# EAGLE schematic V1a (EAGLE 6.5.0)
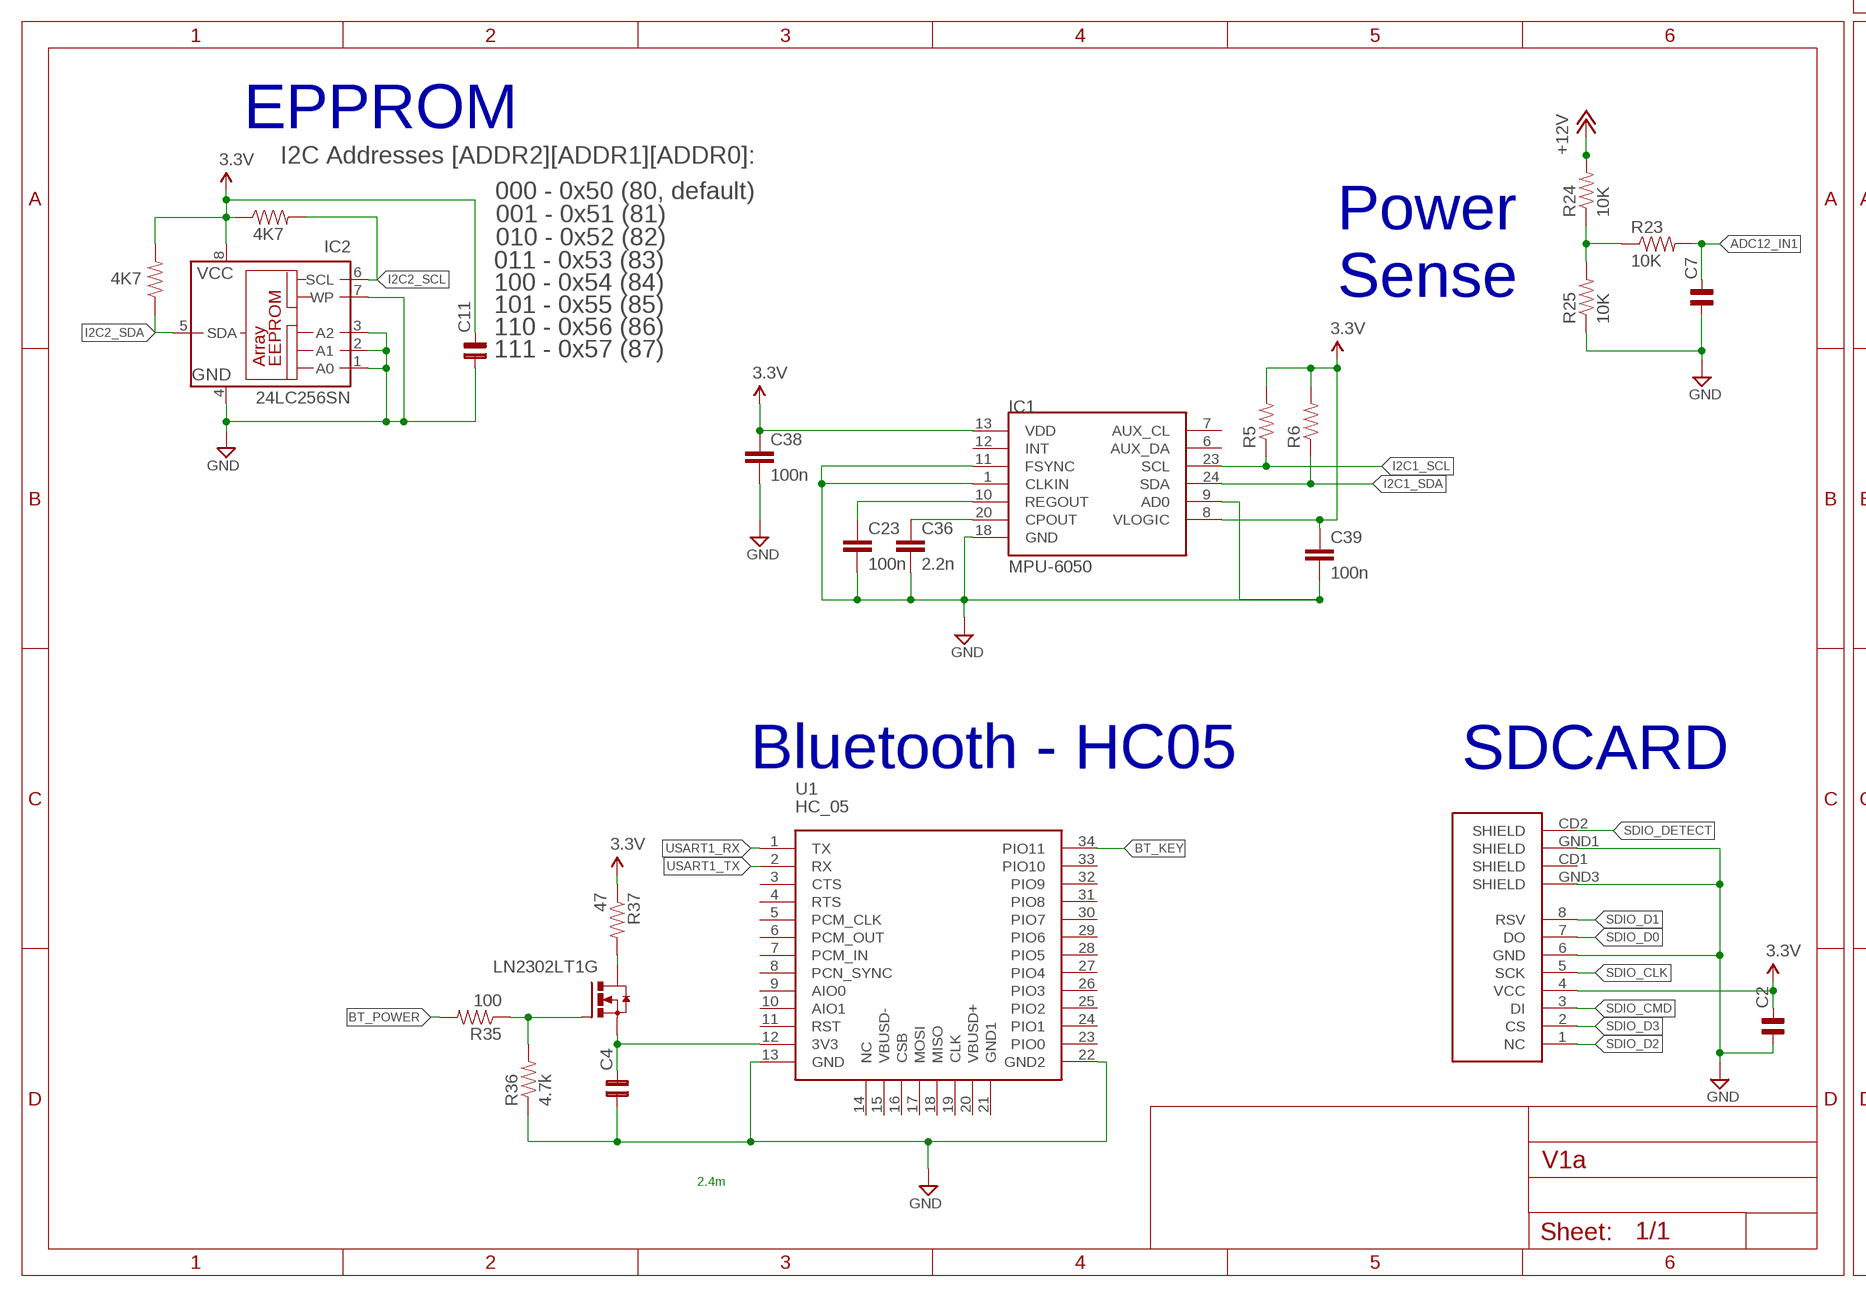
[diagram p0: schematic, sheet 1, part 1 of 2]
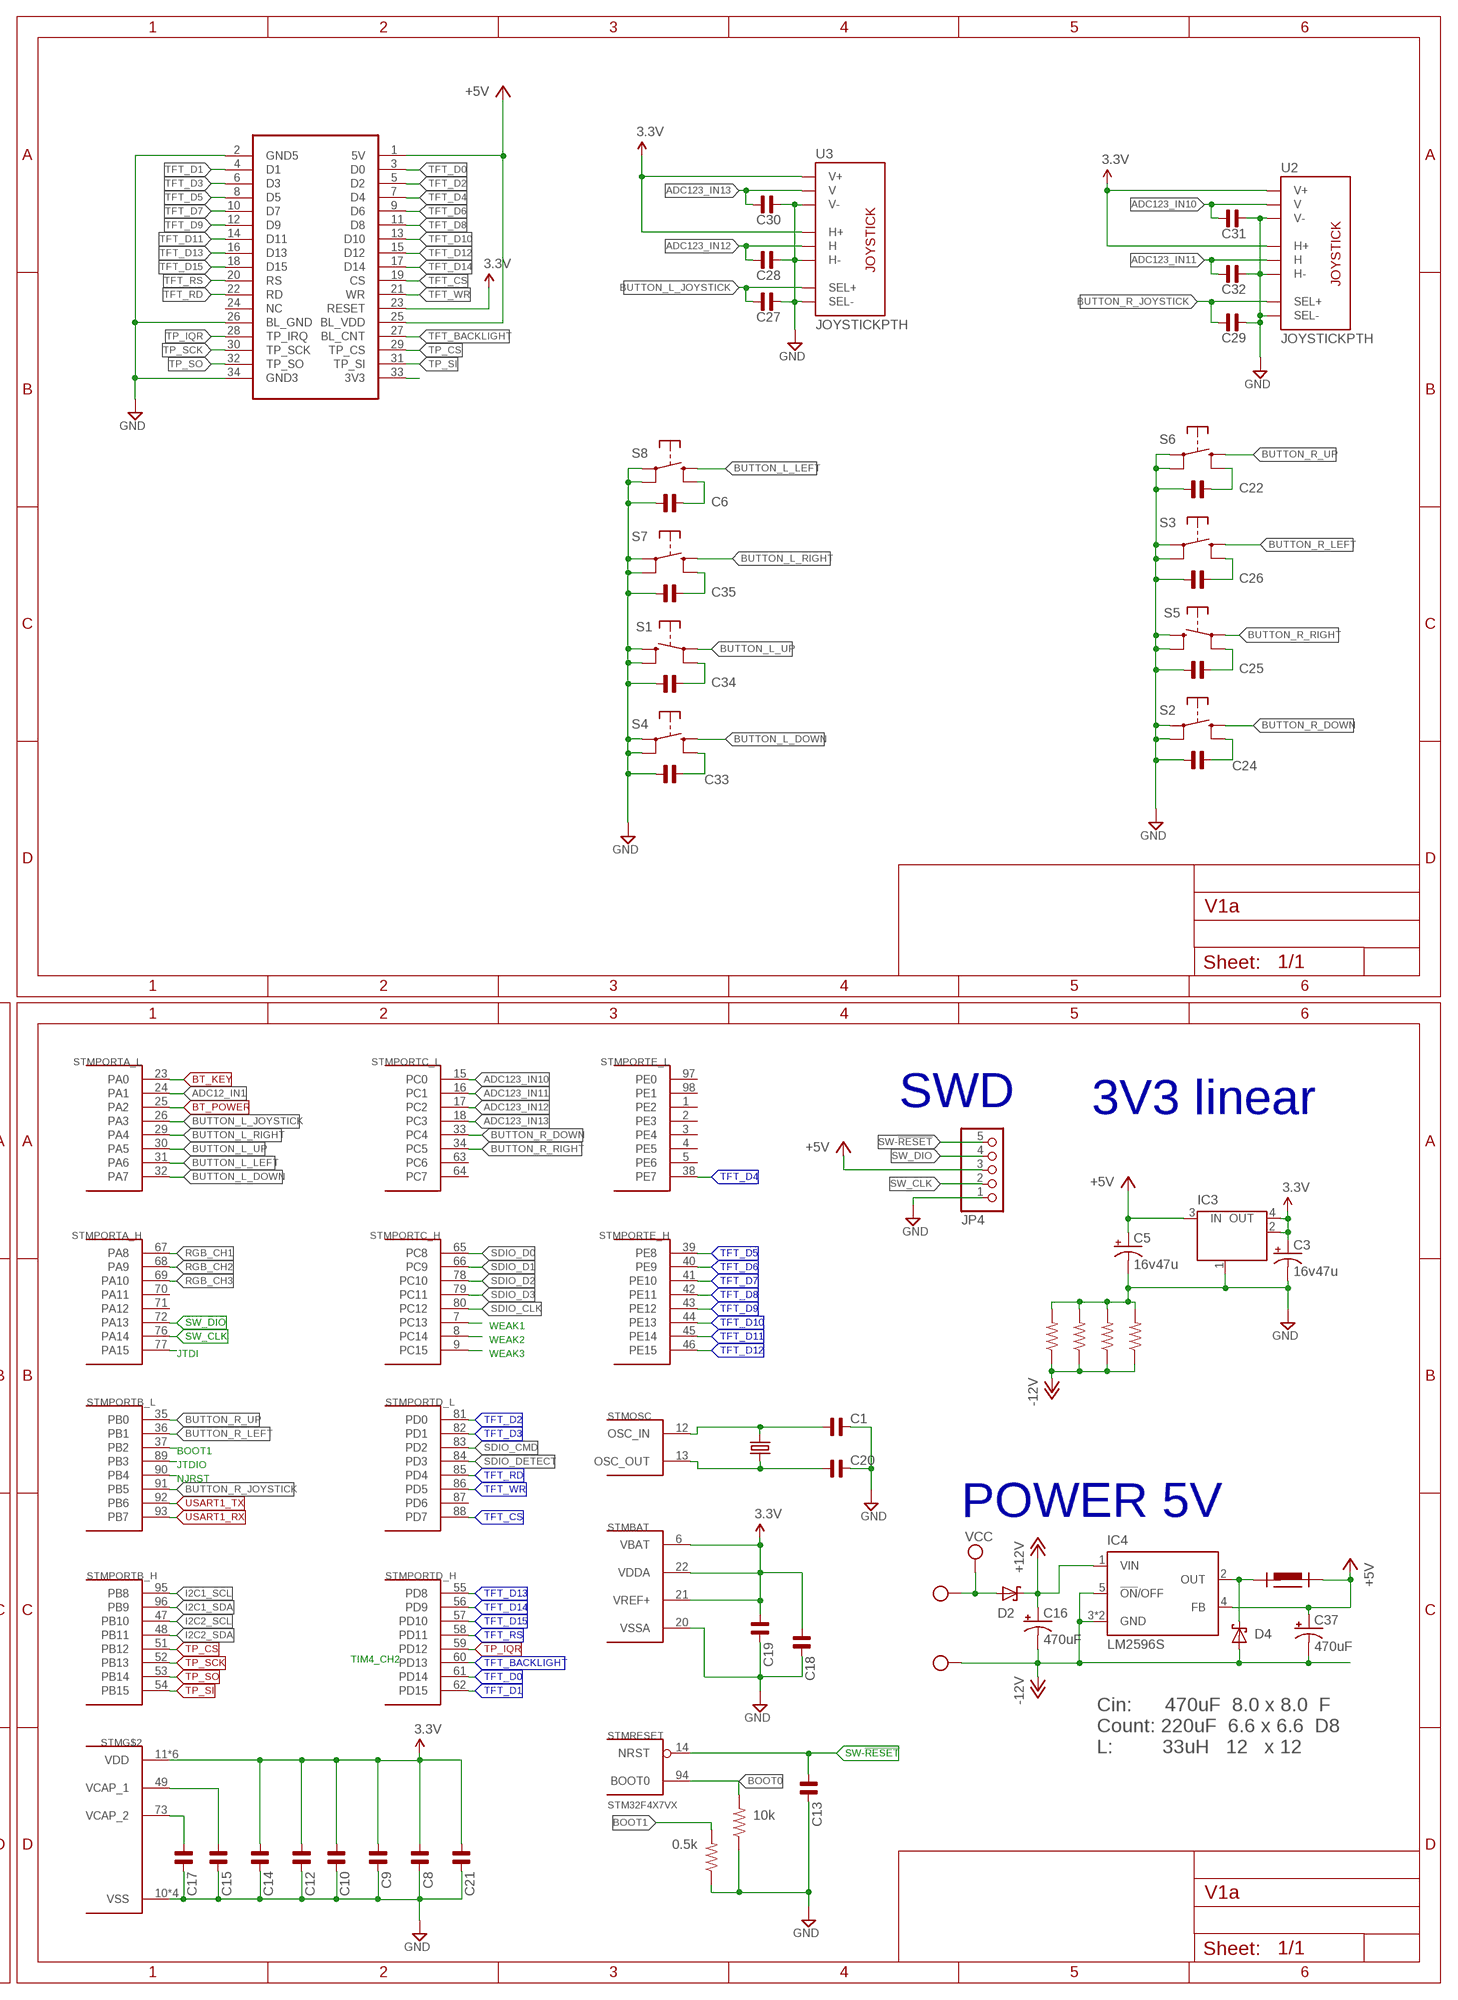
[diagram p1: schematic, sheet 1, part 2 of 2]

## Parts
C1  C-NP-SMD-0603  [C-0603]
C2  C-NP-SMD-0603  [C-0603]
C3  16v47u  CPOL-USSMCC  [SMC_C]
C4  C-NP-SMD-0603  [C-0603]
C5  16v47u  CPOL-USSMCC  [SMC_C]
C6  C-NP-SMD-0603  [C-0603]
C7  C-NP-SMD-0603  [C-0603]
C8  C-NP-SMD-0603  [C-0603]
C9  C-NP-SMD-0603  [C-0603]
C10  C-NP-SMD-0603  [C-0603]
C11  C-NP-SMD-0603  [C-0603]
C12  C-NP-SMD-0603  [C-0603]
C13  C-NP-SMD-0603  [C-0603]
C14  C-NP-SMD-0603  [C-0603]
C15  C-NP-SMD-0603  [C-0603]
C16  470uF  CPOL-US175TMP-0808  [175TMP-0808]
C17  C-NP-SMD-0603  [C-0603]
C18  C-NP-SMD-0603  [C-0603]
C19  C-NP-SMD-0603  [C-0603]
C20  C-NP-SMD-0603  [C-0603]
C21  C-NP-SMD-0603  [C-0603]
C22  C-NP-SMD-0603  [C-0603]
C23  100n  SPARKFUN_CAP0603-CAP  [SPARKFUN_0603-CAP]
C24  C-NP-SMD-0603  [C-0603]
C25  C-NP-SMD-0603  [C-0603]
C26  C-NP-SMD-0603  [C-0603]
C27  C-NP-SMD-0603  [C-0603]
C28  C-NP-SMD-0603  [C-0603]
C29  C-NP-SMD-0603  [C-0603]
C30  C-NP-SMD-0603  [C-0603]
C31  C-NP-SMD-0603  [C-0603]
C32  C-NP-SMD-0603  [C-0603]
C33  C-NP-SMD-0603  [C-0603]
C34  C-NP-SMD-0603  [C-0603]
C35  C-NP-SMD-0603  [C-0603]
C36  2.2n  SPARKFUN_CAP0603-CAP  [SPARKFUN_0603-CAP]
C37  470uF  CPOL-USE/7260-38W  [E/7260-38W]
C38  100n  SPARKFUN_CAP0603-CAP  [SPARKFUN_0603-CAP]
C39  100n  SPARKFUN_CAP0603-CAP  [SPARKFUN_0603-CAP]
D2  MBRS330T3  [SMC]
D4  MBRS330T3  [SMC]
IC1  MPU-6050  TESTING_MPU-6050-1  [TESTING_QFN-24-4MM2]
IC2  24LC256SN  [SO-08]
IC3  LINEAR_MC33269ST-3.3T3  [LINEAR_SOT223]
IC4  LM2596S  [TO263-5]
JP4  PINHD-1X5_2.54-90°  [1X05/90]
LN2302LT1G  FDN327N  [SOT-23]
R1  10k  SPARKFUN_RESISTOR0603-RES  [SPARKFUN_0603-RES]
R2  10k  SPARKFUN_RESISTOR0603-RES  [SPARKFUN_0603-RES]
R3  10k  SPARKFUN_RESISTOR0603-RES  [SPARKFUN_0603-RES]
R4  10k  SPARKFUN_RESISTOR0603-RES  [SPARKFUN_0603-RES]
R5  SPARKFUN_RESISTOR0603-RES  [SPARKFUN_0603-RES]
R6  SPARKFUN_RESISTOR0603-RES  [SPARKFUN_0603-RES]
R7  10k  SPARKFUN_RESISTOR0603-RES  [SPARKFUN_0603-RES]
R8  0.5k  SPARKFUN_RESISTOR0603-RES  [SPARKFUN_0603-RES]
R15  4K7  SPARKFUN_RESISTOR0603-RES  [SPARKFUN_0603-RES]
R16  4K7  SPARKFUN_RESISTOR0603-RES  [SPARKFUN_0603-RES]
R23  10K  SPARKFUN_RESISTOR0603-RES  [SPARKFUN_0603-RES]
R24  10K  SPARKFUN_RESISTOR0603-RES  [SPARKFUN_0603-RES]
R25  10K  SPARKFUN_RESISTOR0603-RES  [SPARKFUN_0603-RES]
R35  100  SPARKFUN_RESISTOR0603-RES  [SPARKFUN_0603-RES]
R36  4.7k  SPARKFUN_RESISTOR0603-RES  [SPARKFUN_0603-RES]
R37  47  SPARKFUN_RESISTOR0603-RES  [SPARKFUN_0603-RES]
S1  RACON12/  [RACON12/]
S2  RACON12/  [RACON12/]
S3  RACON12/  [RACON12/]
S4  RACON12/  [RACON12/]
S5  RACON12/  [RACON12/]
S6  RACON12/  [RACON12/]
S7  RACON12/  [RACON12/]
S8  RACON12/  [RACON12/]
SDCARD2  microSD Socket  USD-SOCKETNEW  [MICRO-SD-SOCKET-PP]
STM  STM32F4X7VX  [TQFP100]
U1  HC_05  [BLUETOOTH_SMD]
U2  JOYSTICKPTH  [JOYSTICK]
U3  JOYSTICKPTH  [JOYSTICK]
U$3  TFT3.2  [HY32D_2]
U$5  BIG_INDUCTOR  [12X12]
X1  MKDSN1,5/2-5,08  [MKDSN1,5/2-5,08]
Y1  CRYSTALHC49US  [HC49US]

## Nets
3.3V: C2.2 C3.+ C8.1 C9.1 C10.1 C11.2 C12.1 C14.1 C18.1 C19.1 C21.1 C38.1 C39.1 IC1.8(VLOGIC) IC1.13(VDD) IC2.8(VCC) IC3.2(OUT) IC3.4(OUT) R5.2 R6.2 R15.1 R16.2 R37.1 SDCARD2.4(VCC) STM.6(BAT:VBAT) STM.11(VDD) STM.19(VDD) STM.21(BAT:VREF+) STM.22(BAT:VDDA) STM.28(VDD) STM.50(VDD) STM.75(VDD) STM.100(VDD) U2.H1(H+) U2.V1(V+) U3.H1(H+) U3.V1(V+) U$3.23(RESET)
+5V: C5.+ C37.+ IC3.3(IN) IC4.4(FB) JP4.3 U$3.1(5V) U$3.25(BL_VDD) U$5.P$1
+12V: C16.+ D2.C IC4.1(VIN) R24.2
-12V: C16.- C37.- D4.A IC4.3(GND) IC4.5(!ON!/OFF) IC4.6(GND) R1.1 R2.1 R3.1 R4.1 X1.1
ADC12_IN1: C7.2 R23.2 STM.24(PORTA_L:PA1)
ADC123_IN10: C31.1 STM.15(PORTC_L:PC0) U2.V2(V)
ADC123_IN11: C32.1 STM.16(PORTC_L:PC1) U2.H2(H)
ADC123_IN12: C28.1 STM.17(PORTC_L:PC2) U3.H2(H)
ADC123_IN13: C30.1 STM.18(PORTC_L:PC3) U3.V2(V)
BOOT0: R7.2 STM.94(RESET:BOOT0)
BOOT1: R8.2 STM.37(PORTB_L:PB2)
BT_KEY: STM.23(PORTA_L:PA0) U1.34(PIO11)
BT_POWER: R35.2 STM.25(PORTA_L:PA2)
BUTTON_L_DOWN: S4.1(S) STM.32(PORTA_L:PA7)
BUTTON_L_JOYSTICK: C27.1 STM.26(PORTA_L:PA3) U3.B1A(SEL+)
BUTTON_L_LEFT: S8.1(S) STM.31(PORTA_L:PA6)
BUTTON_L_RIGHT: S7.1(S) STM.29(PORTA_L:PA4)
BUTTON_L_UP: S1.3(P) STM.30(PORTA_L:PA5)
BUTTON_R_DOWN: S2.1(S) STM.33(PORTC_L:PC4)
BUTTON_R_JOYSTICK: C29.1 STM.91(PORTB_L:PB5) U2.B1A(SEL+)
BUTTON_R_LEFT: S3.1(S) STM.36(PORTB_L:PB1)
BUTTON_R_RIGHT: S5.3(P) STM.34(PORTC_L:PC5)
BUTTON_R_UP: S6.1(S) STM.35(PORTB_L:PB0)
GND: C1.2 C2.1 C3.- C4.1 C5.- C6.1 C7.1 C8.2 C9.2 C10.2 C11.1 C12.2 C13.2 C14.2 C15.2 C17.2 C18.2 C19.2 C20.2 C21.2 C22.1 C23.2 C24.2 C25.2 C26.2 C27.2 C28.2 C29.2 C30.2 C31.2 C32.2 C33.2 C34.2 C35.2 C36.2 C38.2 C39.2 IC1.1(CLKIN) IC1.9(AD0) IC1.11(FSYNC) IC1.18(GND) IC2.1(A0) IC2.2(A1) IC2.3(A2) IC2.4(GND) IC2.7(WP) IC3.1(GND/ADJ) JP4.1 R1.2 R2.2 R3.2 R4.2 R7.1 R8.1 R25.1 R36.1 S1.1(S) S1.2(S) S2.3(P) S2.4(P) S3.3(P) S3.4(P) S4.3(P) S4.4(P) S5.1(S) S5.2(S) S6.3(P) S6.4(P) S7.3(P) S7.4(P) S8.3(P) S8.4(P) SDCARD2.6(GND) SDCARD2.GND1(SHIELD) SDCARD2.GND3(SHIELD) STM.10(VSS) STM.20(BAT:VSSA) STM.27(VSS) STM.74(VSS) STM.99(VSS) U1.13(GND) U1.22(GND2) U2.B2A(SEL-) U2.H3(H-) U2.V3(V-) U3.B2A(SEL-) U3.H3(H-) U3.V3(V-) U$3.2(GND5) U$3.26(BL_GND) U$3.34(GND3)
I2C1_SCL: IC1.23(SCL) R5.1 STM.95(PORTB_H:PB8)
I2C1_SDA: IC1.24(SDA) R6.1 STM.96(PORTB_H:PB9)
I2C2_SCL: IC2.6(SCL) R15.2 STM.47(PORTB_H:PB10)
I2C2_SDA: IC2.5(SDA) R16.1 STM.48(PORTB_H:PB11)
JTDI: STM.77(PORTA_H:PA15)
JTDIO: STM.89(PORTB_L:PB3)
N$1: C1.1 STM.12(OSC:OSC_IN) Y1.2
N$2: C6.2 S8.2(S)
N$3: C23.1 IC1.10(REGOUT)
N$4: C36.1 IC1.20(CPOUT)
N$5: C22.2 S6.2(S)
N$6: C35.1 S7.2(S)
N$7: C25.1 S5.4(P)
N$8: C4.2 LN2302LT1G.2(S) U1.12(3V3)
N$9: C24.1 S2.2(S)
N$10: C26.1 S3.2(S)
N$11: LN2302LT1G.3(D) R37.2
N$12: C34.1 S1.4(P)
N$13: C33.1 S4.2(S)
N$27: R23.1 R24.1 R25.2
N$29: C20.1 STM.13(OSC:OSC_OUT) Y1.1
N$30: U$3.33(3V3)
N$31: C17.1 STM.73(VCAP_2)
N$32: C15.1 STM.49(VCAP_1)
N$34: LN2302LT1G.1(G) R35.1 R36.2
NJRST: STM.90(PORTB_L:PB4)
OUT1: D4.C IC4.2(OUT) U$5.P$2
RGB_CH1: STM.67(PORTA_H:PA8)
RGB_CH2: STM.68(PORTA_H:PA9)
RGB_CH3: STM.69(PORTA_H:PA10)
SDIO_CLK: SDCARD2.5(SCK) STM.80(PORTC_H:PC12)
SDIO_CMD: SDCARD2.3(DI) STM.83(PORTD_L:PD2)
SDIO_D0: SDCARD2.7(DO) STM.65(PORTC_H:PC8)
SDIO_D1: SDCARD2.8(RSV) STM.66(PORTC_H:PC9)
SDIO_D2: SDCARD2.1(NC) STM.78(PORTC_H:PC10)
SDIO_D3: SDCARD2.2(CS) STM.79(PORTC_H:PC11)
SDIO_DETECT: SDCARD2.CD2(SHIELD) STM.84(PORTD_L:PD3)
SW-!RESET: C13.1 JP4.5 STM.14(RESET:NRST)
SW_CLK: JP4.2 STM.76(PORTA_H:PA14)
SW_DIO: JP4.4 STM.72(PORTA_H:PA13)
TFT_BACKLIGHT: STM.60(PORTD_H:PD13) U$3.27(BL_CNT)
TFT_CS: STM.88(PORTD_L:PD7) U$3.19(CS)
TFT_D0: STM.61(PORTD_H:PD14) U$3.3(D0)
TFT_D1: STM.62(PORTD_H:PD15) U$3.4(D1)
TFT_D2: STM.81(PORTD_L:PD0) U$3.5(D2)
TFT_D3: STM.82(PORTD_L:PD1) U$3.6(D3)
TFT_D4: STM.38(PORTE_L:PE7) U$3.7(D4)
TFT_D5: STM.39(PORTE_H:PE8) U$3.8(D5)
TFT_D6: STM.40(PORTE_H:PE9) U$3.9(D6)
TFT_D7: STM.41(PORTE_H:PE10) U$3.10(D7)
TFT_D8: STM.42(PORTE_H:PE11) U$3.11(D8)
TFT_D9: STM.43(PORTE_H:PE12) U$3.12(D9)
TFT_D10: STM.44(PORTE_H:PE13) U$3.13(D10)
TFT_D11: STM.45(PORTE_H:PE14) U$3.14(D11)
TFT_D12: STM.46(PORTE_H:PE15) U$3.15(D12)
TFT_D13: STM.55(PORTD_H:PD8) U$3.16(D13)
TFT_D14: STM.56(PORTD_H:PD9) U$3.17(D14)
TFT_D15: STM.57(PORTD_H:PD10) U$3.18(D15)
TFT_RD: STM.85(PORTD_L:PD4) U$3.22(RD)
TFT_RS: STM.58(PORTD_H:PD11) U$3.20(RS)
TFT_WR: STM.86(PORTD_L:PD5) U$3.21(WR)
TP_CS: STM.51(PORTB_H:PB12) U$3.29(TP_CS)
TP_IQR: STM.59(PORTD_H:PD12) U$3.28(TP_IRQ)
TP_SCK: STM.52(PORTB_H:PB13) U$3.30(TP_SCK)
TP_SI: STM.54(PORTB_H:PB15) U$3.31(TP_SI)
TP_SO: STM.53(PORTB_H:PB14) U$3.32(TP_SO)
USART1_RX: STM.93(PORTB_L:PB7) U1.1(TX)
USART1_TX: STM.92(PORTB_L:PB6) U1.2(RX)
VCC: D2.A X1.2
WEAK1: STM.7(PORTC_H:PC13)
WEAK2: STM.8(PORTC_H:PC14)
WEAK3: STM.9(PORTC_H:PC15)
Unconnected: IC1.6(AUX_DA) IC1.7(AUX_CL) IC1.12(INT) SDCARD2.CD1(SHIELD) STM.1(PORTE_L:PE2) STM.2(PORTE_L:PE3) STM.3(PORTE_L:PE4) STM.4(PORTE_L:PE5) STM.5(PORTE_L:PE6) STM.63(PORTC_L:PC6) STM.64(PORTC_L:PC7) STM.70(PORTA_H:PA11) STM.71(PORTA_H:PA12) STM.87(PORTD_L:PD6) STM.97(PORTE_L:PE0) STM.98(PORTE_L:PE1) U1.3(CTS) U1.4(RTS) U1.5(PCM_CLK) U1.6(PCM_OUT) U1.7(PCM_IN) U1.8(PCN_SYNC) U1.9(AIO0) U1.10(AIO1) U1.11(RST) U1.14(NC) U1.15(VBUSD-) U1.16(CSB) U1.17(MOSI) U1.18(MISO) U1.19(CLK) U1.20(VBUSD+) U1.21(GND1) U1.23(PIO0) U1.24(PIO1) U1.25(PIO2) U1.26(PIO3) U1.27(PIO4) U1.28(PIO5) U1.29(PIO6) U1.30(PIO7) U1.31(PIO8) U1.32(PIO9) U1.33(PIO10) U$3.24(NC)

## Notes on the sheet
- EPPROM
- SWD
- I2C Addresses [ADDR2][ADDR1][ADDR0]: | 3V3 linear
- 000 - 0x50 (80, default)
- 001 - 0x51 (81)
- 010 - 0x52 (82)
- 011 - 0x53 (83)
- 100 - 0x54 (84)
- Power
  Sense
- 101 - 0x55 (85)
- 110 - 0x56 (86)
- 111 - 0x57 (87)
- POWER 5V
- SDCARD
- Bluetooth - HC05
- TIM4_CH2
- Cin:      470uF  8.0 x 8.0  F
  Count: 220uF  6.6 x 6.6  D8
  L:         33uH   12   x 12
- 2.4m
- TJA1040

## Library data of the parts
C1 C2 C4 C6-C15 C17-C22 C24-C35 = cap-pan40:C-NP: NON-POLARIZED FILM/CHIP
C3 C5 = rcl:CPOL-US: POLARIZED CAPACITOR, American symbol
C16 C37 = adafruit:CPOL-US: POLARIZED CAPACITOR, American symbol
C23 C36 C38 C39 = Helios_RLC:SPARKFUN_CAP: Capacitor Standard 0603 ceramic capacitor, and 0.1" leaded capacitor.
D2 D4 = Robotech Diode of Chung:MBRS3*0T3: SCHOTTKY BARRIER RECTIFIER 3.0 AMPERES 20, 30, 40 VOLT Source: MBRS340T3-D.pdf
IC1 = Helios_IMU:TESTING_MPU-6050
IC2 = microchip:24*: Serial EEPROM I2C; DIGIKEY: 24LC256-E/SN-ND; MF: MICROCHIP; MPN: 24LC256-I/SN; OC_FARNELL: 9757996; OC_NEWARK: 27C9144
IC3 = Robotech_Other:LINEAR_MC33269ST*: Adjustable Output Low Dropout Voltage Regulator 800 mA Source: http://www.onsemi.com/pub/Collateral/MC33269-D.PDF
IC4 = national-semiconductor:LM2596: SIMPLE SWITCHER® Power Converter 150 kHz 3A Step-Down Voltage Regulator Source: http://www.national.com/ds/LM/LM2596.pdf; MF: NATIONAL SEMICONDUCTOR; MPN: LM2596S-ADJ/NOPB; OC_FARNELL: 9494367; OC_NEWARK: 41K3842
JP4 = pinhead-1:PINHD-1X5: PIN HEADER
LN2302LT1G = TESTWORK_PIM_PIC32MX795F512L:FDN327N
R1-R4 R7 R8 R15 R16 R23-R25 = Robotech_RCL:SPARKFUN_RESISTOR: Resistor Basic schematic elements and footprints for 0603, 1206, and PTH resistors.
R5 R6 = Helios_RLC:SPARKFUN_RESISTOR: Resistor Basic schematic elements and footprints for 0603, 1206, and PTH resistors.
R35-R37 = HMC5883L_Breakout-v11:SPARKFUN_RESISTOR: Resistor Basic schematic elements and footprints for 0603, 1206, and PTH resistors.
S1-S8 = switch-misc:RACON12: ITT SWITCH
SDCARD2 = SparkFun:USD-SOCKET: microSD Socket Push-push type uSD socket. Schematic element and footprint production proven. Spark Fun Electronics SKU : PRT-00127. tDoc lines correctly indicate media card edge positions when inserting (unlocked, locked, depressed).
STM = pixhawk2:STM32F4X7VX: STM32F4X7VX 100 pin LQFP STM32F407VE - 512 KB flash, no crypto STM32F407VG - 1 MB flash, no crypto STM32F417VE - 512 KB flash, with crypto STM32F417VG - 1 MB flash, with crypto; PARTNO: STM32F427VI
U1 = SerialPortBluetooth:HC_05
U2 U3 = SparkFun:JOYSTICK: Thumb Joystick Joystick commonly found in PS2 controllers. Two pots and a select switch. Footprint proven. Spark Fun Electronics SKU : COM-09032
U$3 = TFT:TFT3.2
U$5 = Big_inductor:BIG_INDUCTOR
X1 = con-phoenix-508:MKDSN1,5/2-5,08: MKDSN 1,5/ 2-5,08 Printklemme Nennstrom: 13,5 A Nennspannung: 250 V Rastermaß: 5,08 mm Polzahl: 2 Anschlussart: Schraubanschluss Montage: Löten Anschlussrichtung Leiter/Platine: 0 ° Artikelnummer: 1729128 Source: http://eshop.phoenixcontact.com .. 1729128.pdf; MPN: MKDSN 1,5/2-5.08; OC_FARNELL: 1792903; OC_NEWARK: 30M2397
Y1 = SparkFun-FreqCtrl:CRYSTAL: Various standard crystals. Proven footprints. Spark Fun Electronics SKU : COM-00534

## Net classes
1 power: width 0.15 mm, drill 0.2 mm, clearance 0.152 mm